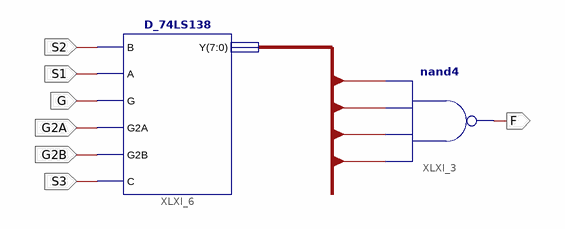
[diagram p0: schematic sheet 1]
// Xilinx ISE schematic LampCtrl138.sch (kintex7) as structural Verilog: 2 symbols, 7 ports
module LampCtrl138 (
  input  S2,
  input  S1,
  input  G,
  input  G2A,
  input  G2B,
  input  S3,
  output F
);

  wire [7:0] Y;

  nand XLXI_3 (F, Y[4], Y[2], Y[1], Y[7]);
  D_74LS138 XLXI_6 (.B(S2), .A(S1), .G(G), .G2A(G2A), .G2B(G2B), .C(S3), .Y(Y));
endmodule
